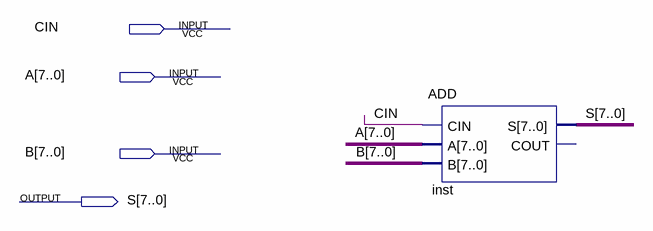
[diagram p0: schematic sheet]
// Quartus schematic ADD_SUB.bdf as structural Verilog: 1 symbols, 4 pins
module ADD_SUB (
  input  CIN,
  input  [7:0] A,
  input  [7:0] B,
  output [7:0] S
);

  ADD inst (.CIN(CIN), .A(A), .B(B), .S(S));  // open: COUT
endmodule
